# EAGLE schematic powerBoard (EAGLE 9.4.2)
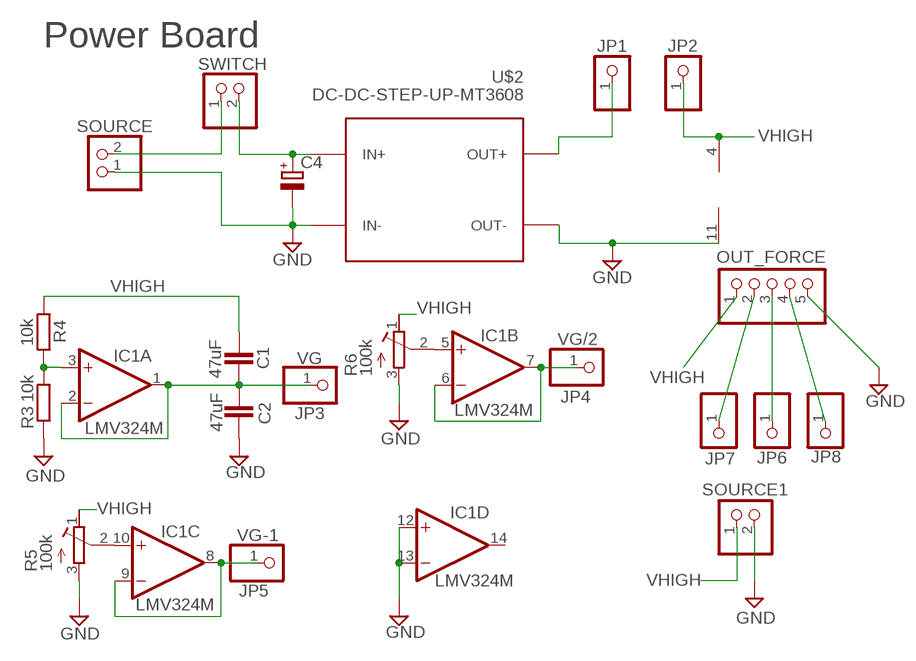
[diagram p0: schematic, sheet 1]

## Parts
C1  47uF  C-EUC0805  [C0805]
C2  47uF  C-EUC0805  [C0805]
C4  CPOL-EUE2.5-7  [E2,5-7]
IC1  LMV324M  [SO14]
JP1  PINHD-1X1  [1X01]
JP2  PINHD-1X1  [1X01]
JP3  PINHD-1X1  [1X01]
JP4  PINHD-1X1  [1X01]
JP5  PINHD-1X1  [1X01]
JP6  PINHD-1X1  [1X01]
JP7  PINHD-1X1  [1X01]
JP8  PINHD-1X1  [1X01]
OUT_FORCE  PINHD-1X5  [1X05]
R3  10k  R-EU_R0805  [R0805]
R4  10k  R-EU_R0805  [R0805]
R5  100k  R-TRIMM3006P  [RTRIM3006P]
R6  100k  R-TRIMM3006P  [RTRIM3006P]
SOURCE  PINHD-1X2  [1X02]
SOURCE1  PINHD-1X2  [1X02]
SWITCH  PINHD-1X2  [1X02]
U$2  DC-DC-STEP-UP-MT3608  [DC-DC-STEP-UP-MT3608]

## Nets
GND: C2.2 C4.- IC1.11(P:V-) IC1.12(D:+IN) IC1.13(D:-IN) OUT_FORCE.5 R3.1 R5.3(A) R6.3(A) SOURCE1.2 SOURCE.1 U$2.IN- U$2.OUT-
N$1: JP1.1 U$2.OUT+
N$2: IC1.3(A:+IN) R3.2 R4.2
N$3: SOURCE.2 SWITCH.1
N$4: C4.+ SWITCH.2 U$2.IN+
N$5: IC1.10(C:+IN) R5.2(S)
N$6: IC1.5(B:+IN) R6.2(S)
N$7: JP8.1 OUT_FORCE.4
N$8: JP6.1 OUT_FORCE.3
N$9: JP7.1 OUT_FORCE.2
VG: C1.2 C2.1 IC1.1(A:OUT) IC1.2(A:-IN) JP3.1
VG-1: IC1.8(C:OUT) IC1.9(C:-IN) JP5.1
VG/2: IC1.6(B:-IN) IC1.7(B:OUT) JP4.1
VHIGH: C1.1 IC1.4(P:V+) JP2.1 OUT_FORCE.1 R4.1 R5.1(E) R6.1(E) SOURCE1.1
Unconnected: IC1.14(D:OUT)

## Notes on the sheet
- Power Board

## Library data of the parts
C1 C2 = rcl:C-EU: CAPACITOR, European symbol; SPICEPREFIX: C
C4 = rcl3:CPOL-EU: POLARIZED CAPACITOR, European symbol; SPICEPREFIX: C
IC1 = linear:LMV324?*: Quad General Purpose, Low Voltage, Rail-to-Rail Output Operational Amplifiers Source: http://www.national.com/mpf/LM/LMV321.html http://www.national.com/dt/lmv_qual.pdf
JP1-JP8 = pinhead:PINHD-1X1: PIN HEADER
OUT_FORCE = pinhead:PINHD-1X5: PIN HEADER
R3 R4 = rcl:R-EU_: RESISTOR, European symbol; SPICEPREFIX: R
R5 R6 = rcl2:R-TRIMM: Trimm resistor; SPICEMODEL: X; SPICEPREFIXL: POT
SOURCE SOURCE1 SWITCH = pinhead:PINHD-1X2: PIN HEADER
U$2 = diy-modules_me2:DC-DC-STEP-UP-MT3608: DC/DC Step-Up Regulator based on MT3608 chip MT3608 datasheet available here: https://www.olimex.com/Products/Breadboarding/BB-PWR-3608/resources/MT3608.pdf Click here to find device on ebay.com <http://www.ebay.com/sch/mt3608+module>